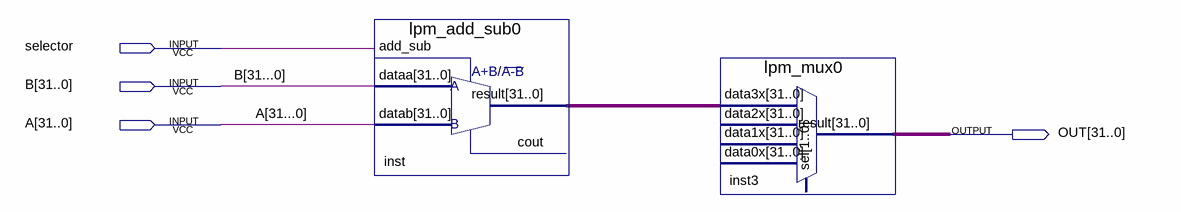
[diagram p0: schematic sheet]
// Quartus schematic 32bit_ALU.bdf as structural Verilog: 2 symbols, 4 pins
module \32bit_ALU  (
  input  selector,
  input  [31:0] B,
  input  [31:0] A,
  output [31:0] OUT
);

  wire \A[31...0] , \B[31...0] ;
  wire [31:0] inst_result;

  lpm_add_sub0 inst (
    .add_sub(selector), .dataa({32{\B[31...0] }}), .datab({32{\A[31...0] }}), .result(inst_result));  // open: cout
  lpm_mux0 inst3 (.data3x(inst_result), .result(OUT));  // open: data2x, data1x, data0x, sel
endmodule
